# Altium schematic sheet SW1106 100W 单C SH2.SchDoc
size A4; SheetNumber: 2; SheetTotal: 2
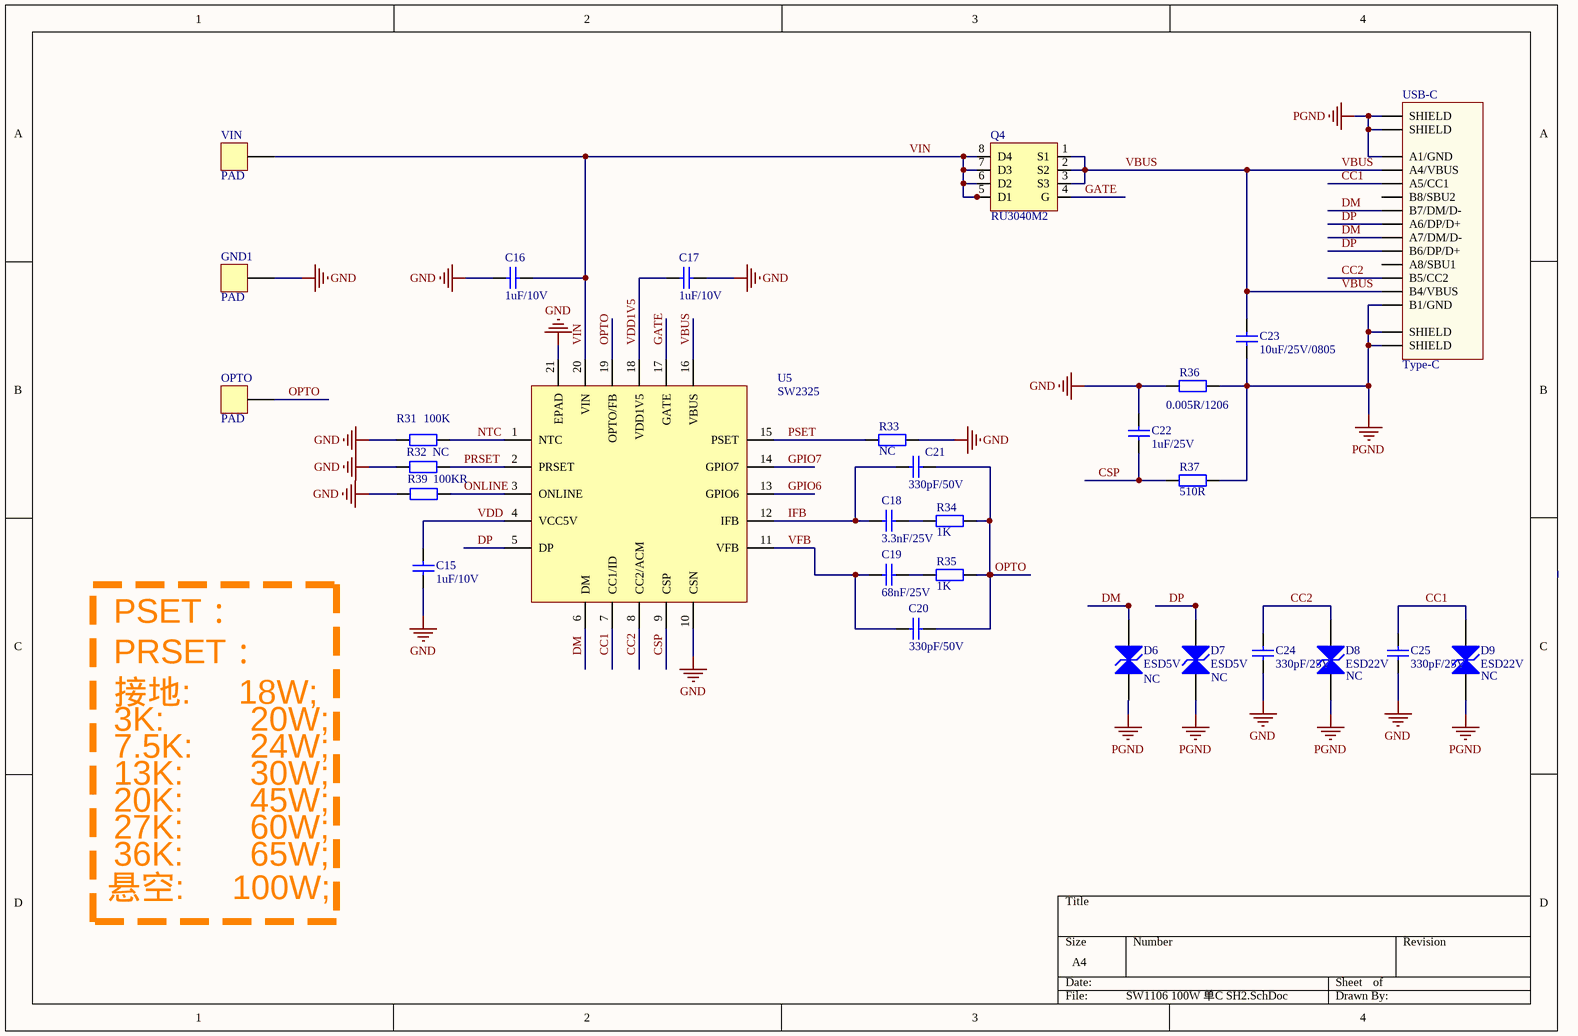
[diagram p0: SW1106 100W 单C SH2.SchDoc]

## Parts
C15  1uF/10V  [C 0603]
C16  1uF/10V  [C 0603]
C17  1uF/10V  [C 0603]
C18  3.3nF/25V  [C 0603]
C19  68nF/25V  [C 0603]
C20  330pF/50V  [C 0603]
C21  330pF/50V  [C 0603]
C22  1uF/25V  [C 0603]
C23  10uF/25V/0805  [C 0805]
C24  330pF/25V  [C 0603]
C25  330pF/25V  [C 0603]
D6  ESD5V  [SOD-523]
D7  ESD5V  [SOD-523]
D8  ESD22V  [SOD-523]
D9  ESD22V  [SOD-523]
GND1  PAD  [PAD]
OPTO  PAD  [PAD]
Q4  RU3040M2  [PDFN-3*3]
R31  100K  [R 0603]
R32  NC  [R 0603]
R33  NC  [R 0603]
R34  1K  [R 0603]
R35  1K  [R 0603]
R36  0.005R/1206  [R 1206]
R37  510R  [R 0603]
R39  100KR  [R 0603]
U5  SW2325  [SW232X_QFN20-4X4]
USB-C  Type-C  [USB_C_16PIN]
VIN  PAD  [PAD]

## Nets
GND: C15.1 C16.1 C17.1 C22.2 C24.1 C25.1 GND1.1(PAD) R31.1 R32.1 R33.2 R36.1 R39.1 U5.10(CSN) U5.21(EPAD)
PGND: C23.1 D6.1(A) D7.1(A) D8.1(A) D9.1(A) R36.2 R37.2 USB-C.1(SHIELD) USB-C.2(SHIELD) USB-C.3(SHIELD) USB-C.4(SHIELD) USB-C.A1(A1/GND) USB-C.B1(B1/GND)
CC1: C25.2 D9.2(K) U5.7(CC1/ID) USB-C.A5(A5/CC1)
CC2: C24.2 D8.2(K) U5.8(CC2/ACM) USB-C.B5(B5/CC2)
CSP: C22.1 R37.1 U5.9(CSP)
DM: D6.2(K) U5.6(DM) USB-C.A7(A7/DM/D-) USB-C.B7(B7/DM/D-)
DP: D7.2(K) U5.5(DP) USB-C.A6(A6/DP/D+) USB-C.B6(B6/DP/D+)
GATE: Q4.4(G) U5.17(GATE)
GPIO6: U5.13(GPIO6)
GPIO7: U5.14(GPIO7)
IFB: C18.1 C21.1 U5.12(IFB)
NTC: R31.2 U5.1(NTC)
ONLINE: R39.2 U5.3(ONLINE)
OPTO: C20.2 C21.2 OPTO.1(PAD) R34.2 R35.2 U5.19(OPTO/FB)
PRSET: R32.2 U5.2(PRSET)
PSET: R33.1 U5.15(PSET)
VBUS: C23.2 Q4.1(S1) Q4.2(S2) Q4.3(S3) U5.16(VBUS) USB-C.A4(A4/VBUS) USB-C.B4(B4/VBUS)
VDD: C15.2 U5.4(VCC5V)
VDD1V5: C17.2 U5.18(VDD1V5)
VFB: C19.1 C20.1 U5.11(VFB)
VIN: C16.2 Q4.5(D1) Q4.6(D2) Q4.7(D3) Q4.8(D4) Q4.9(EPAD) U5.20(VIN) VIN.1(PAD)
NetC18_2: C18.2 R34.1
NetC19_2: C19.2 R35.1

Not connected (* = marked no-connect by the designer): USB-C A8(A8/SBU1) B8(B8/SBU2)

## Notes on the sheet
- PSET：
- 接地:     18W;
- PRSET：
- (near D6) NC
- (near D7) NC
- (near D8) NC
- (near D9) NC
- 3K:         20W;
- 7.5K:      24W;
- 13K:       30W;
- 20K:       45W;
- 27K:       60W;
- 悬空:     100W;
- 36K:       65W;

## Library data of the parts
C15-C25 = Capacitor: 电容-无极性
D6-D9 = Diode_ESD: 防静电二极管
Q4 = MOSFET-PDFN: PDFN封装N-MOS
R31-R37 R39 = Resistance: 电阻
U5 = SW2325: 智融科技SW2325
USB-C = Type-C_16Pin: USB-C